# Altium schematic sheet MCU152A_ADC.SchDoc
size 431 x 279 mm; Date: Not shown in title block; ApprovedBy: Not shown in title block; CheckedBy: Not shown in title block; Author: Not shown in title block; CompanyName: Not shown in title block; Engineer: Not shown in title block; Organization: Not shown in title block; Address1: Not shown in title block; Address2: Not shown in title block; Address3: Not shown in title block; Address4: Not shown in title block; DocumentNumber: 5; Revision: Use project parameter SCH_Rev; SheetNumber: 5; SheetTotal: 8; PageSetup: Record=PageOptions|CenterHorizontal=True|CenterVertical=True|PrintScale=1.00|XCorrection=1.00|YCorrection=1.00|PrintKind=0|BorderSize=5000000|LeftOffset=0|BottomOffset=0|Orientation=2|PaperLength=1000|PaperWidth=1000|Scale=100|PaperSource=15|PrintQuality=600|MediaType=1|DitherType=10|PaperKind=Letter|PrintScaleMode=1; CurrentTime: Not shown in title block; CurrentDate: Not shown in title block; Time: Not shown in title block; DocumentFullPathAndName: Not shown in title block; DocumentName: Not shown in title block; ModifiedDate: Not shown in title block; ImagePath: Not shown in title block
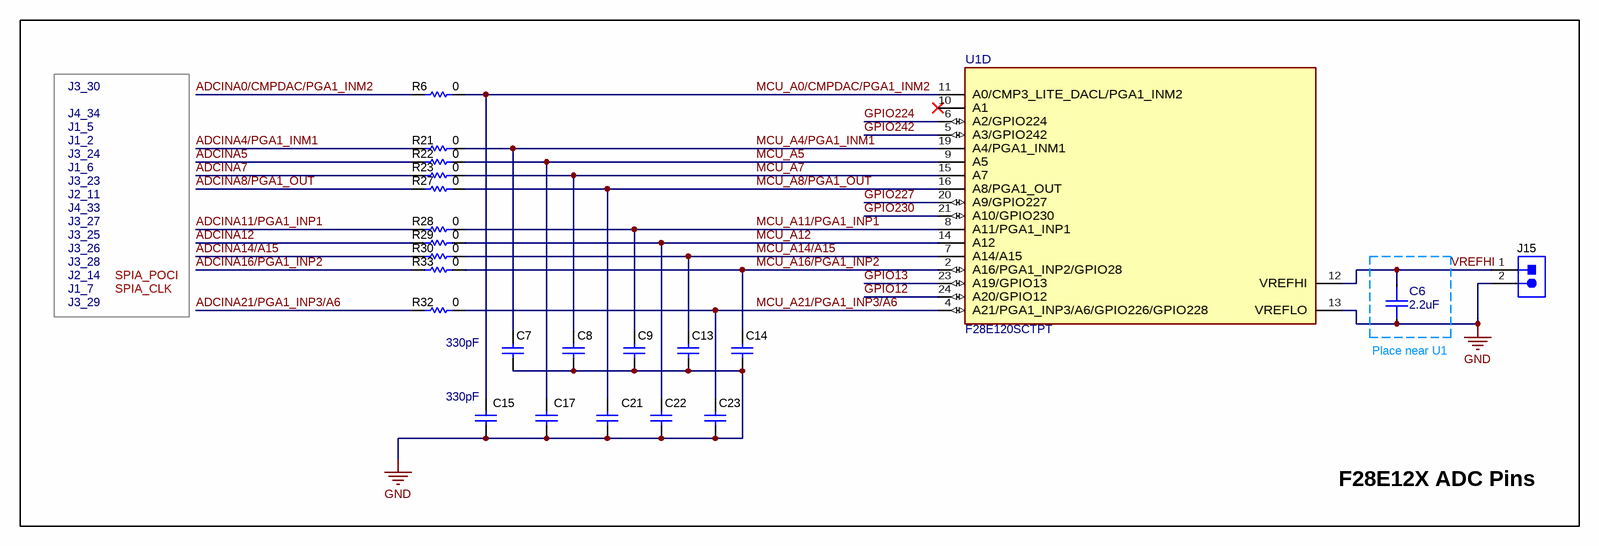
[diagram p0: MCU152A_ADC.SchDoc]

## Parts
C6  ValueDisplayed: 2.2uF  [FP-885012106011_0603-MFG]  (hidden comment: 885012106011)
C7  value 330pF  [0402]  (hidden comment: GRM1555C1H331JA01D)
C8  GRM1555C1H331JA01D  [0402]  (value not drawn)
C9  GRM1555C1H331JA01D  [0402]  (value not drawn)
C13  GRM1555C1H331JA01D  [0402]  (value not drawn)
C14  GRM1555C1H331JA01D  [0402]  (value not drawn)
C15  value 330pF  [0402]  (hidden comment: GRM1555C1H331JA01D)
C17  GRM1555C1H331JA01D  [0402]  (value not drawn)
C21  GRM1555C1H331JA01D  [0402]  (value not drawn)
C22  GRM1555C1H331JA01D  [0402]  (value not drawn)
C23  GRM1555C1H331JA01D  [0402]  (value not drawn)
J15  61300211121  [WURTH_61300211121]  (value not drawn)
R6  ValueDisplayed: 0  [0402]  (hidden comment: RC0402JR-070RL)
R21  ValueDisplayed: 0  [0402]  (hidden comment: RC0402JR-070RL)
R22  ValueDisplayed: 0  [0402]  (hidden comment: RC0402JR-070RL)
R23  ValueDisplayed: 0  [0402]  (hidden comment: RC0402JR-070RL)
R27  ValueDisplayed: 0  [0402]  (hidden comment: RC0402JR-070RL)
R28  ValueDisplayed: 0  [0402]  (hidden comment: RC0402JR-070RL)
R29  ValueDisplayed: 0  [0402]  (hidden comment: RC0402JR-070RL)
R30  ValueDisplayed: 0  [0402]  (hidden comment: RC0402JR-070RL)
R32  ValueDisplayed: 0  [0402]  (hidden comment: RC0402JR-070RL)
R33  ValueDisplayed: 0  [0402]  (hidden comment: RC0402JR-070RL)
U1  F28E120SCTPT  [PT0048A-MFG]  (part D of 4)

## Nets
GND: C6.2 C7.2 C8.2 C9.2 C13.2 C14.2 C15.2 C17.2 C21.2 C22.2 C23.2 J15.2 U1.13(VREFLO)
ADCINA0/CMPDAC/PGA1_INM2: R6.1
ADCINA4/PGA1_INM1: R21.1
ADCINA5: R22.1
ADCINA7: R23.1
ADCINA8/PGA1_OUT: R27.1
ADCINA11/PGA1_INP1: R28.1
ADCINA12: R29.1
ADCINA14/A15: R30.1
ADCINA16/PGA1_INP2: R33.1
ADCINA21/PGA1_INP3/A6: R32.1
GPIO12: U1.24(A20/GPIO12)
GPIO13: U1.23(A19/GPIO13)
GPIO224: U1.6(A2/GPIO224)
GPIO227: U1.20(A9/GPIO227)
GPIO230: U1.21(A10/GPIO230)
GPIO242: U1.5(A3/GPIO242)
MCU_A0/CMPDAC/PGA1_INM2: C15.1 R6.2 U1.11(A0/CMP3_LITE_DACL/PGA1_INM2)
MCU_A4/PGA1_INM1: C7.1 R21.2 U1.19(A4/PGA1_INM1)
MCU_A5: C17.1 R22.2 U1.9(A5)
MCU_A7: C8.1 R23.2 U1.15(A7)
MCU_A8/PGA1_OUT: C21.1 R27.2 U1.16(A8/PGA1_OUT)
MCU_A11/PGA1_INP1: C9.1 R28.2 U1.8(A11/PGA1_INP1)
MCU_A12: C22.1 R29.2 U1.14(A12)
MCU_A14/A15: C13.1 R30.2 U1.7(A14/A15)
MCU_A16/PGA1_INP2: C14.1 R33.2 U1.2(A16/PGA1_INP2/GPIO28)
MCU_A21/PGA1_INP3/A6: C23.1 R32.2 U1.4(A21/PGA1_INP3/A6/GPIO226/GPIO228)
VREFHI: C6.1 J15.1 U1.12(VREFHI)

Not connected (* = marked no-connect by the designer): U1 10(A1)*

## Notes on the sheet
- J3_30
- J4_34
- J1_5
- J3_23
- J1_6
- J1_2
- J3_24
- J3_27
- J3_26
- J3_25
- J3_28
- J2_11
- J4_33
- J3_29
- J1_7
- J2_14
- SPIA_CLK
- SPIA_POCI
- (near C6) Place near U1
- F28E12X ADC Pins
- Drawn By:
- SVN Rev:
- Number:
- TID #:
- Orderable:
- Rev:
- Sheet Title:
- File:
- Project Title:
- Designed for:
- Assembly Variant:
- Mod. Date:
- Sheet:
- Size:
- of
- B
- http://www.ti.com
- Texas Instruments and/or its licensors do not warrant the accuracy or completeness of this specification or any information contained therein. Texas Instruments and/or its licensors do not warrant that this design will meet the specifications, will be suitable for your application or fit for any particular purpose, or will operate in an implementation. Texas Instruments and/or its licensors do not warrant that the design is production worthy. You should completely validate and test your design implementation to confirm the system functionality for your application.
- Engineer:
- Contact:
- © Texas Instruments

## Library data of the parts
C6 = CMP-0124925-1: 2.2 µF ±20% 10V Ceramic Capacitor X5R 0603 (1608 Metric); Manufacturer: Wurth Electronics; AEC Qualified: No; Cap_F: 2.2µF; SizeZ_mm: 0.87mm; TempCo: 15%; Value: 2.2µF; PackageReference: 0603; PartNumber: 885012106011; RoHS: TRUE; Supplier 1: Digikey; Supplier 2: Mouser; Supplier Part Number 1: 732-7908-1-ND; Supplier Part Number 2: 710-885012106011; Tolerance_%: 20%; VDC_V: 10V; Part Number: 885012106011; datasheet: https://www.we-online.com/components/products/datasheet/885012106011.pdf; Datasheet Date: 2021-01-03; Datasheet Path: datasheets/Cap-885012106011.pdf; Datasheet Version: 002.000; Digikey Description: CAP CER 2.2UF 10V X5R 0603; Digikey Part Number: 732-7908-1-ND; helpURL: https://upverter.com/upn/revision/043a68a068ea15af/; Lead Free: Yes; Mouser Part Number: 710-885012106011; Operating Temperature Range: -55°C to +85°C; Temperature Characteristic: X5R; ComponentLink1Description: Datasheet; ComponentLink1URL: https://www.we-online.com/components/products/datasheet/885012106011.pdf
C7 C15 = CMP-0006456-2: CAP, CERM, 330 pF, 50 V, +/- 5%, C0G/NP0, 0402; Manufacturer: MuRata; TaMin_C: -55°C; Polarized: N; SizeAreaWB_mm2: 3; Value1: Unknown; U/M: EA; TaMax_C: 125°C; SizeZ_mm: 0.6; SizeX_mm: 1; SizeY_mm: 0.5; Value2: 50V; AEC Category: Q200; Supplier Part Number 2: 81-GRM155C1H331JA01D; Publisher: Texas Instruments; Supplier 2: Mouser; Supplier Part Number 3: 8819653; TempCo: C0G/NP0; Supplier 3: Farnell; Published: 2008-06-19; RoHS: Y; MountType: SMT; Supplier 1: Digi-Key; PackageReference: 0402; Tolerance_%: 5%; Cap_Case: 0402; SizeArea_mm2: 0.5; CompType: Capacitor; LatestRevisionDate: 2017-03-09; PartNumber: GRM1555C1H331JA01D; AEC Qualified: ?; Cap_F: 330pF; ComponentLink1Description: Datasheet link; Supplier Part Number 1: 490-1295-1-ND; Technology: Ceramic; ValueDisplayed: 330pF; ComponentLink1URL: http://search.murata.co.jp/Ceramy/PnsearchViewAction.do?HnOFG=ON&HnNFG=ON&SEL_CNT=50&sLang=en&sKey=GRM1555C1H331JA01D&x=9&y=9&search=startwith; VDC_V: 50V
C8 C9 C13 C14 C17 C21-C23 = CMP-0006456-2: CAP, CERM, 330 pF, 50 V, +/- 5%, C0G/NP0, 0402; Manufacturer: MuRata; TaMin_C: -55°C; Polarized: N; SizeAreaWB_mm2: 3; Value1: Unknown; U/M: EA; Value: 330pF; TaMax_C: 125°C; SizeZ_mm: 0.6; SizeX_mm: 1; SizeY_mm: 0.5; Value2: 50V; AEC Category: Q200; Supplier Part Number 2: 81-GRM155C1H331JA01D; Publisher: Texas Instruments; Supplier 2: Mouser; Supplier Part Number 3: 8819653; TempCo: C0G/NP0; Supplier 3: Farnell; Published: 2008-06-19; RoHS: Y; MountType: SMT; Supplier 1: Digi-Key; PackageReference: 0402; Tolerance_%: 5%; Cap_Case: 0402; SizeArea_mm2: 0.5; CompType: Capacitor; LatestRevisionDate: 2017-03-09; PartNumber: GRM1555C1H331JA01D; AEC Qualified: ?; Cap_F: 330pF; ComponentLink1Description: Datasheet link; Supplier Part Number 1: 490-1295-1-ND; Technology: Ceramic; ValueDisplayed: 330pF; ComponentLink1URL: http://search.murata.co.jp/Ceramy/PnsearchViewAction.do?HnOFG=ON&HnNFG=ON&SEL_CNT=50&sLang=en&sKey=GRM1555C1H331JA01D&x=9&y=9&search=startwith; VDC_V: 50V
J15 = CMP-0054794-1: Header, 2.54 mm, 2x1, Gold, TH; Manufacturer: Wurth Elektronik; Green_Lifecycle: Active; Green_REACh: Passed; CNHeader: TRUE; CT: FALSE; PartNumber: 61300211121; PackageReference: Header, 2.54mm, 2x1, TH; ClassName: Header; CompType: Header; RoHS: Y; MountType: TH; ComponentLink1Description: Datasheet URL; ComponentLink1URL: http://katalog.we-online.de/em/datasheet/6130xx11121.pdf; Publisher: Texas Instruments; LatestRevisionDate: 26/05/2017; Supplier 1: Digi-Key; Supplier Part Number 1: 732-5315-ND; Supplier 2: Newark; Supplier Part Number 2: 20X0948; Supplier 3: Mouser; Supplier Part Number 3: 710-61300211121; Green_EU RoHS: Passed; Green_EU RoHS-2: Incomplete
R6 R21-R23 R27-R30 R32 R33 = CMP-0027004-2: RES, 0, 5%, 0.063 W, 0402; Manufacturer: Yageo America; Power_W: 63mW; TempCo: 200 ppm/C; Value_Code: 0000; U/M: EA; Value: 0; EIA_Code: E24; SizeX_mm: 1; SizeY_mm: 0.5; SizeZ_mm: 0.6; Value2: 0.063W; VDC_V: 50V; AEC Category: Q200; Supplier Part Number 2: 603-RC0402JR-070RL; Publisher: Texas Instruments; Supplier 2: Mouser; Supplier Part Number 3: 9232516; Supplier 3: Farnell; Published: 2008-06-26; RoHS: Y; Value1: 5%; MountType: SMT; Supplier 1: Digi-Key; PackageReference: 0402; Tolerance_%: 5%; Res_ohm: 0; SizeArea_mm2: 0.5; CompType: Resistor; LatestRevisionDate: 2017-03-09; PartNumber: RC0402JR-070RL; AEC Qualified: ?; ComponentLink1Description: Datasheet link; Supplier Part Number 1: 311-0.0JRCT-ND; Technology: Thick Film; ComponentLink1URL: http://www.yageo.com/pdf/Pu-RC0402_51_PbFree_L_2.pdf
U1 = CMP-0125361-1: F28E12x Real-Time Microcontrollers; Manufacturer: Texas Instruments; SizeZ_mm: 1.6mm; Core Architecture: C28x; Data Bus Width: 32bits; Frequency_Fixed: 160MHz; Interface: I2C,SPI,UART,SCI; Max Supply Voltage: 3.63V; Memory Size: 128KBytes; Memory Type: FLASH; Min Supply Voltage: 2.8V; Number Of A/D Converters: 1; Number Of Adc Channels: 9; Number Of I/Os: 27; Number Of Pwm Channels: 8; Number Of Timers/Counters: 4; Number Of Uart Channels: 2; Ram Size: 16KBytes; Standoff Height: 0.05mm; TJmax_C: +125°C; PackageReference: LQFP48; PartNumber: F28E120SCTPT; RoHS: UNKNOWN; Operating Temperature Range: -40°C to +125°C; Part Number: F28E120SCTPT; Datasheet Path: datasheets/IC-F28E120SCTPT.pdf; helpURL: https://upverter.com/upn/revision/b1ad6dff89e73838/; Number Of Cores: 1; Number Of I2C Channels: 1; Number Of Spi Channels: 1; PartId: 1